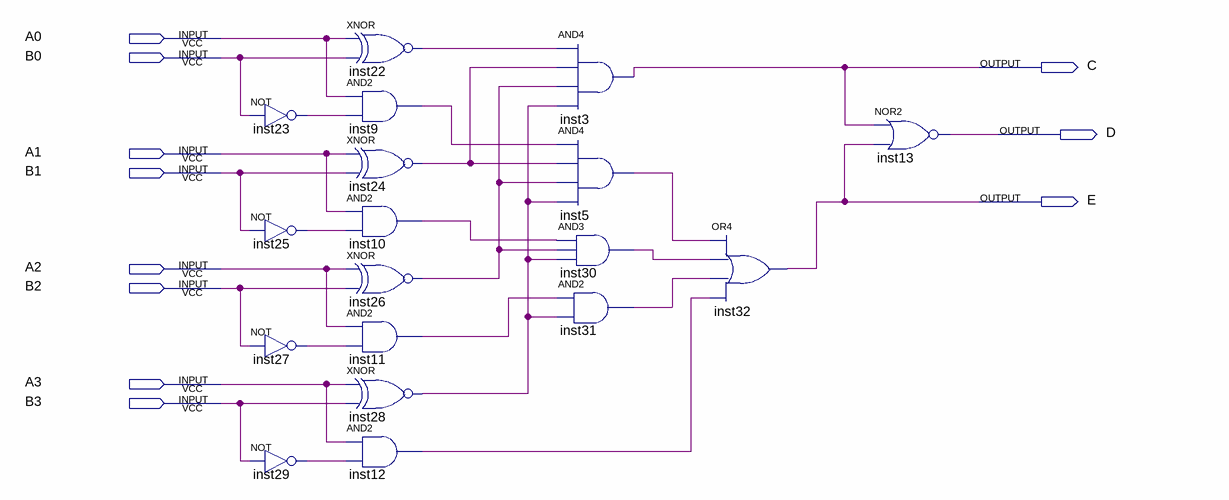
[diagram p0: schematic sheet]
// Quartus schematic next.bdf as structural Verilog: 18 symbols, 11 pins
module next (
  input  A0,
  input  B0,
  input  A1,
  input  B1,
  input  A2,
  input  B2,
  input  A3,
  input  B3,
  output C,
  output D,
  output E
);

  wire inst5_out, inst9_out, inst10_out, inst11_out, inst12_out, inst22_out, inst23_out, inst24_out,
       inst25_out, inst26_out, inst27_out, inst28_out, inst29_out, inst30_out, inst31_out;

  not inst23 (inst23_out, B0);
  not inst25 (inst25_out, B1);
  not inst27 (inst27_out, B2);
  not inst29 (inst29_out, B3);
  xnor inst22 (inst22_out, A0, B0);
  and inst9 (inst9_out, A0, inst23_out);
  xnor inst24 (inst24_out, A1, B1);
  and inst10 (inst10_out, A1, inst25_out);
  xnor inst26 (inst26_out, A2, B2);
  and inst11 (inst11_out, A2, inst27_out);
  xnor inst28 (inst28_out, A3, B3);
  and inst12 (inst12_out, A3, inst29_out);
  and inst3 (C, inst22_out, inst24_out, inst26_out, inst28_out);
  and inst5 (inst5_out, inst9_out, inst24_out, inst26_out, inst28_out);
  and inst30 (inst30_out, inst10_out, inst26_out, inst28_out);
  and inst31 (inst31_out, inst11_out, inst28_out);
  or inst32 (E, inst5_out, inst30_out, inst31_out, inst12_out);
  nor inst13 (D, C, E);
endmodule
